# Altium schematic sheet KEY.SchDoc
size A4
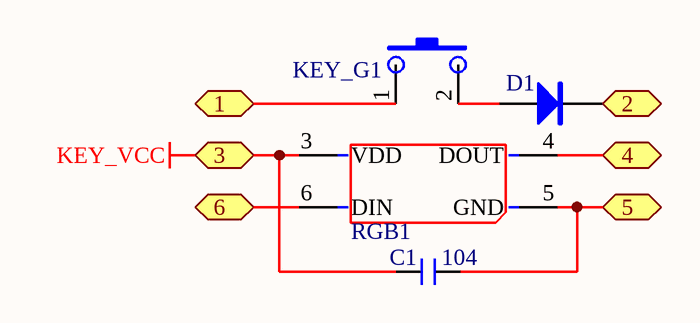
[diagram p0: KEY.SchDoc]

## Parts
C1  104  [0805]
D1  1N4148W-7-F  [SOD-123]  (value not drawn)
KEY_G1  KEY_G  [GATERON]  (value not drawn)
RGB1  RGB  [WS2812]  (value not drawn)

## Ports
1 (bidir), 2 (bidir), 3 (bidir), 4 (bidir), 5 (bidir), 6 (bidir)

## Nets
KEY_VCC: C1.1 RGB1.3(VDD) ; port 3
1: KEY_G1.1 ; port 1
2: D1.2(K) ; port 2
4: RGB1.4(DOUT) ; port 4
5: C1.2 RGB1.5(GND) ; port 5
6: RGB1.6(DIN) ; port 6
NetD1_1: D1.1(A) KEY_G1.2

## Library data of the parts
C1 = C: 贴片电容
D1 = 1N4148: 开关二极管
KEY_G1 = GATERON: with Fixation pins  1-Pole w/Diode
RGB1 = WS2812: with Fixation pins  1-Pole w/Diode